# Altium project SEMA_V7 Motor Controller4.12.PrjPcb (part 1 of 2)
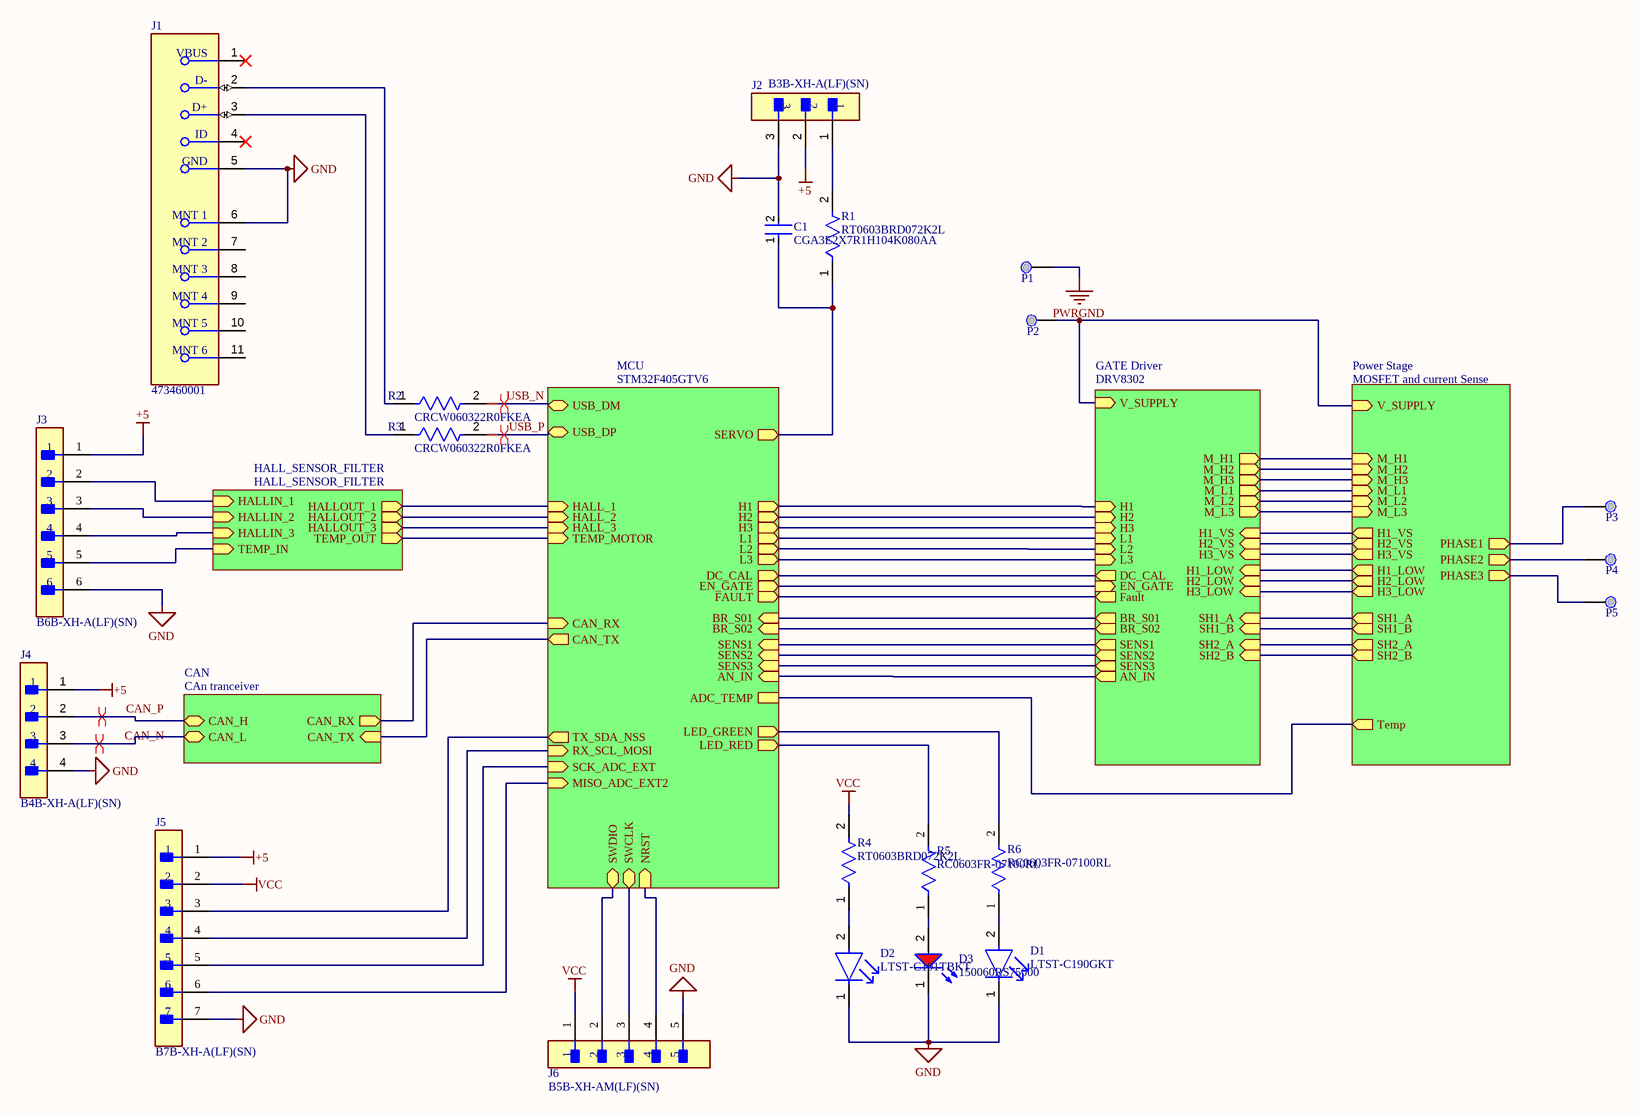
[diagram p0: General.SchDoc]
6 sheets, 124 parts. Net scope: hierarchical (ports join the sheet entries above them; power ports are global).
Board file: PCB.PcbDoc
Sheets:
  General.SchDoc
    MCU = STM32F405GTV6.SchDoc
    GATE Driver = DRV8302.SchDoc
    Power Stage = MOSFET and current Sense.SchDoc
    HALL_SENSOR_FILTER = HALL_SENSOR_FILTER.SchDoc
    CAN = CAn tranceiver.SchDoc

## Sheet General.SchDoc
size 431 x 279 mm; SheetNumber: 1; SheetTotal: 6

### Parts
C1  CGA3E2X7R1H104K080AA  [FP-CGA3E-0_3-0_1-IPC_A]
D1  LTST-C190GKT  [FP-LTST-C190GKT-MFG]
D2  LTST-C191TBKT  [FP-LTST-C191TBKT-MFG]
D3  150060RS75000  [WL-SMCW_0603_150060xx75000]
J1  473460001  [FP-473460001-MFG]
J2  B3B-XH-A(LF)(SN)  [FP-B3B-XH-A_LF_SN-MFG]
J3  B6B-XH-A(LF)(SN)  [FP-B6B-XH-A_LF_SN-MFG]
J4  B4B-XH-A(LF)(SN)  [FP-B4B-XH-A_LF_SN-MFG]
J5  B7B-XH-A(LF)(SN)  [FP-B7B-XH-A_LF_SN-MFG]
J6  B5B-XH-AM(LF)(SN)  [FP-B5B-XH-AM_LF_SN-MFG]
P1  Power_Pad  [PowerPad]  (value not drawn)
P2  Power_Pad  [PowerPad]  (value not drawn)
P3  Power_Pad  [PowerPad]  (value not drawn)
P4  Power_Pad  [PowerPad]  (value not drawn)
P5  Power_Pad  [PowerPad]  (value not drawn)
R1  RT0603BRD072K2L  [FP-RT0603-MFG]
R2  CRCW060322R0FKEA  [FP-CRCW0603-e3-IPC_B]
R3  CRCW060322R0FKEA  [FP-CRCW0603-e3-IPC_B]
R4  RT0603BRD072K2L  [FP-RT0603-MFG]
R5  RC0603FR-07100RL  [FP-RC0603-0_55-MFG]
R6  RC0603FR-07100RL  [FP-RC0603-0_55-MFG]

### Sub-sheets
CAN = CAn tranceiver: CAN_RX (out), CAN_TX (in), CAN_H (bidir), CAN_L (bidir)
GATE Driver = DRV8302: H1 (in), H2 (in), H3 (in), L1 (in), L2 (in), L3 (in), Fault (out), DC_CAL (out), EN_GATE (in), BR_S01 (out), BR_S02 (out), SENS1 (out), SENS2 (out), SENS3 (out), V_SUPPLY (in), AN_IN (out), SH1_A (in), SH1_B (in), SH2_A (in), SH2_B (in), M_H1 (out), M_H2 (out), M_H3 (out), M_L1 (out), M_L2 (out), M_L3 (out), H1_VS (in), H2_VS (in), H3_VS (in), H1_LOW (in), H2_LOW (in), H3_LOW (in)
HALL_SENSOR_FILTER = HALL_SENSOR_FILTER: HALLIN_1 (in), HALLIN_2 (in), HALLIN_3 (in), TEMP_IN (in), TEMP_OUT (out), HALLOUT_1 (out), HALLOUT_2 (out), HALLOUT_3 (out)
MCU = STM32F405GTV6: HALL_1 (in), HALL_2 (in), HALL_3 (in), TEMP_MOTOR (in), USB_DM (bidir), USB_DP (bidir), CAN_RX (in), CAN_TX (out), H1 (out), H2 (out), H3 (out), L1 (out), L2 (out), L3 (out), DC_CAL (out), EN_GATE (out), FAULT (out), BR_S01 (in), BR_S02 (in), SENS1 (in), SENS2 (in), SENS3 (in), ADC_TEMP, AN_IN (in), LED_GREEN (out), LED_RED (out), TX_SDA_NSS (out), SCK_ADC_EXT (in), MISO_ADC_EXT2 (in), RX_SCL_MOSI (in), SERVO (out), SWDIO (bidir), SWCLK (bidir), NRST (in)
Power Stage = MOSFET and current Sense: V_SUPPLY (in), M_H1 (in), M_H2 (in), M_H3 (in), M_L1 (in), M_L2 (in), M_L3 (in), H1_VS (out), H2_VS (out), H3_VS (out), H1_LOW (out), H2_LOW (out), H3_LOW (out), SH1_A (out), SH1_B (out), SH2_A (out), SH2_B (out), PHASE1 (out), PHASE2 (out), PHASE3 (out), Temp (out)

### Nets
+5: J2.2 J3.1 J4.1 J5.1
GND: C1.2 D1.1(C) D2.1(C) D3.1(K) J1.5(GND) J1.6(MNT_1) J2.3 J3.6 J4.4 J5.7 J6.5 P1.P?(Power) ; sheet GATE Driver/H2_LOW, sheet Power Stage/H2_LOW  [also labelled PWRGND]  [project net H2_LOW]
VCC: J5.2 J6.1 R4.2
CAN_N: J4.3 ; sheet CAN/CAN_L
CAN_P: J4.2 ; sheet CAN/CAN_H
CURR_1_N: sheet GATE Driver/SH2_B, sheet Power Stage/SH2_B
CURR_1_P: sheet GATE Driver/SH2_A, sheet Power Stage/SH2_A
CURR_2_N: sheet GATE Driver/SH1_B, sheet Power Stage/SH1_B
CURR_2_P: sheet GATE Driver/SH1_A, sheet Power Stage/SH1_A
H1_LOW: sheet GATE Driver/H1_LOW, sheet Power Stage/H1_LOW
H1_VS: P3.P?(Power) ; sheet GATE Driver/H1_VS, sheet Power Stage/H1_VS, sheet Power Stage/PHASE1
H2_VS: P4.P?(Power) ; sheet GATE Driver/H2_VS, sheet Power Stage/H2_VS, sheet Power Stage/PHASE2
H3_LOW: sheet GATE Driver/H3_LOW, sheet Power Stage/H3_LOW
H3_VS: P5.P?(Power) ; sheet GATE Driver/H3_VS, sheet Power Stage/H3_VS, sheet Power Stage/PHASE3
RX_SCL_MOSI: J5.4 ; sheet MCU/RX_SCL_MOSI
TX_SDA_NSS: J5.3 ; sheet MCU/TX_SDA_NSS
USB_N: R2.2 ; sheet MCU/USB_DM
USB_P: R3.2 ; sheet MCU/USB_DP
V_SUPPLY: P2.P?(Power) ; sheet GATE Driver/V_SUPPLY, sheet Power Stage/V_SUPPLY
NetC1_1: C1.1 R1.1 ; sheet MCU/SERVO
NetC2_1: J6.4 ; sheet MCU/NRST
NetC13_1: J3.5 ; sheet MCU/TEMP_MOTOR, sheet HALL_SENSOR_FILTER/TEMP_IN, sheet HALL_SENSOR_FILTER/TEMP_OUT
NetC14_1: sheet MCU/HALL_1, sheet HALL_SENSOR_FILTER/HALLOUT_1
NetC15_1: sheet MCU/HALL_2, sheet HALL_SENSOR_FILTER/HALLOUT_2
NetC16_1: sheet MCU/HALL_3, sheet HALL_SENSOR_FILTER/HALLOUT_3
NetC23_1: sheet MCU/AN_IN, sheet GATE Driver/AN_IN
NetC45_1: sheet MCU/ADC_TEMP, sheet Power Stage/Temp
NetD1_2: D1.2(A) R6.1
NetD2_2: D2.2(A) R4.1
NetD3_2: D3.2(A) R5.1
NetJ1_2: J1.2(D-) R2.1
NetJ1_3: J1.3(D+) R3.1
NetJ2_1: J2.1 R1.2
NetJ3_2: J3.2 ; sheet HALL_SENSOR_FILTER/HALLIN_1
NetJ3_3: J3.3 ; sheet HALL_SENSOR_FILTER/HALLIN_2
NetJ3_4: J3.4 ; sheet HALL_SENSOR_FILTER/HALLIN_3
NetJ5_5: J5.5 ; sheet MCU/SCK_ADC_EXT
NetJ5_6: J5.6 ; sheet MCU/MISO_ADC_EXT2
NetJ6_2: J6.2 ; sheet MCU/SWDIO
NetJ6_3: J6.3 ; sheet MCU/SWCLK
NetR5_2: R5.2 ; sheet MCU/LED_RED
NetR6_2: R6.2 ; sheet MCU/LED_GREEN
NetR26_1: sheet MCU/SENS1, sheet GATE Driver/SENS1
NetR27_1: sheet MCU/SENS2, sheet GATE Driver/SENS2
NetR28_1: sheet MCU/SENS3, sheet GATE Driver/SENS3
NetR32_1: sheet GATE Driver/M_H1, sheet Power Stage/M_H1
NetR33_1: sheet GATE Driver/M_H2, sheet Power Stage/M_H2
NetR34_1: sheet GATE Driver/M_H3, sheet Power Stage/M_H3
NetR36_1: sheet GATE Driver/M_L1, sheet Power Stage/M_L1
NetR37_1: sheet GATE Driver/M_L2, sheet Power Stage/M_L2
NetR38_1: sheet GATE Driver/M_L3, sheet Power Stage/M_L3
NetU1_26: sheet MCU/BR_S02, sheet GATE Driver/BR_S02
NetU1_27: sheet MCU/BR_S01, sheet GATE Driver/BR_S01
NetU1_33: sheet MCU/DC_CAL, sheet GATE Driver/DC_CAL
NetU1_34: sheet MCU/L3, sheet GATE Driver/L3
NetU1_35: sheet MCU/L2, sheet GATE Driver/L2
NetU1_36: sheet MCU/L1, sheet GATE Driver/L1
NetU1_41: sheet MCU/H3, sheet GATE Driver/H3
NetU1_42: sheet MCU/H2, sheet GATE Driver/H2
NetU1_43: sheet MCU/H1, sheet GATE Driver/H1
NetU1_51: sheet MCU/EN_GATE, sheet GATE Driver/EN_GATE
NetU1_53: sheet MCU/FAULT, sheet GATE Driver/Fault
NetU1_61: sheet MCU/CAN_RX, sheet CAN/CAN_RX
NetU1_62: sheet MCU/CAN_TX, sheet CAN/CAN_TX

Not connected (* = marked no-connect by the designer): J1 1(VBUS)* 4(ID)* 7(MNT_2) 8(MNT_3) 9(MNT_4) 10(MNT_5) 11(MNT_6)

### Layout directives
differential pair: CAN_N, CAN_P, USB_N, USB_P

### Notes on the sheet
- DWG. NO.
- REV.
- SHT.
- THIS DOCUMENT AND THE DATA DISCLOSED HEREIN OR HEREWITH IS THE PROPERTY OF ALTIUM LIMITED AND MAY BE FREELY DISTRIBUTED IN WHOLE. NO RIGHTS ARE RESERVED OR EXPRESS OR IMPLIED WARANTEE GIVEN.
- REVISION
- DESCRIPTION
- DATE
- APPROVED
- ENG:
- APPROVALS
- PROJECT
- DSN:
- CHK:
- REFERENCE DOCUMENTS
- PROJECT REVISION:
- TITLE
- DOCUMENT REVISION:
- DESIGN ITEM:
- BOM:
- FAB DWG:
- PCB DWG:
- ASSY DWG:
- SCALE:
- SIZE
- B
- CAGE CODE
- FILE NAME
- DWG NO.
- SHEET
- OF
- REV

### Library data of the parts
C1 = CMP-2000-07546-2: Cap Ceramic 100nF 50V X7R 10% Pad SMD 0603 +125°C Automotive T/R; Weight: 7.1E-05oz; Composition: Ceramic; Max Operating Temperature: 125°C; Termination: SMD/SMT; Dielectric: X7R; Length: 1.6mm; Package Quantity: 1; REACH SVHC: No SVHC; Lead Free: Lead Free; Case Code (Metric): 1608; Min Operating Temperature: -55°C; Packaging: Tape and Reel; Tolerance: 10%; Voltage Rating: 50V; Case Code (Imperial): 0603; Capacitance: 100nF; Case/Package: 0603; Voltage Rating (DC): 50V; Depth: 0.8mm; Radiation Hardening: No; Ratings: AEC-Q200; Mount: Surface Mount; Voltage: 50V; Thickness: 0.035inch; Width: 0.8mm; Height: 0.8mm
D1 = CMP-22017-000005-2: LED GREEN CLEAR CHIP SMD; Dominant Wavelength: 569nm; Reverse Voltage: 5V; Lens Color: Colorless; Viewing Angle: 130°; Voltage: 2V; Forward Current: 30mA; Power Dissipation: 100mW; Luminous Intensity: 6mcd; Number of LEDs: 1; Forward Voltage: 2.1V; Wavelength: 565nm; Test Current: 10mA; Min Operating Temperature: -55°C; Lens Style: Clear; Mount: Surface Mount; Width: 0.8mm; Packaging: Tape and Reel; Lens Transparency: Clear; Case Code (Metric): 1608; Depth: 0.8mm; Case Code (Imperial): 0603; Case/Package: 0603; Number of Pins: 2; Max Operating Temperature: 85°C; Lead Free: Lead Free; Number of Elements: 1; Length: 1.6mm; Height: 0.8mm; Package Quantity: 1; Power Rating: 100mW; Radiation Hardening: No; Illumination Color: Green; Color: Green
D2 = CMP-22017-000008-1: LED BLUE CLEAR CHIP SMD; Lens Color: Colorless; Dominant Wavelength: 475nm; Forward Current: 20mA; Wavelength: 468nm; Viewing Angle: 130°; Power Dissipation: 76mW; Luminous Intensity: 180mcd; Reverse Voltage: 5V; Number of Elements: 1; Lens Style: Diffused; Forward Voltage: 3.8V; Max Power Dissipation: 75mW; Case Code (Metric): 1608; Packaging: Tape and Reel; Case/Package: 0603; Depth: 1.6mm; Mount: Surface Mount; Lead Free: Lead Free; Min Operating Temperature: -20°C; Lens Transparency: Clear; Illumination Color: Blue; Height: 0.55mm; Test Current: 20mA; Case Code (Imperial): 0603; Max Operating Temperature: 80°C; Number of Pins: 2; Length: 0.8mm; Radiation Hardening: No; Package Quantity: 1; Number of LEDs: 1; Width: 0.8mm; Color: Blue
D3 = CMP-1426-00001-3: NexarPartId: 29717776; Color: Red; Power Dissipation: 72mW; Max Reverse Voltage (DC): 5V; Peak Wavelength: 630nm; Viewing Angle: 140°; Forward Voltage: 2V; Luminous Intensity: 250mcd; Forward Current: 100mA; Dominant Wavelength: 625nm; Lens Style: Clear, Rectangular; Max Junction Temperature (Tj): 95°C; Test Current: 20mA; Mount: Surface Mount; Packaging: Tape and Reel; Case Code (Metric): 1608; Max Operating Temperature: 85°C; Case Code (Imperial): 0603; REACH SVHC: Unknown; Width: 800µm; Length: 1.6mm; Reverse Voltage: 5V; Height: 700µm; Case/Package: 0603; RoHS: Compliant; Wavelength: 625nm; Min Operating Temperature: -40°C
J1 = CMP-2000-05246-2: CONN RCPT USB2.0 MICRO B SMD R/A; Manufacturer: Molex; Conn Orientation: Right Angle; Is Female: yes; Shielding: true; Pitch: 0.65mm; Number Of Contacts: 5; Voltage Rating: 30V; Current Rating: 1.8A; Device Class L2: USB Connectors; Digikey Description: CONN RCPT USB2.0 MICRO B SMD R/A; Height: 2.945mm; RoHS: TRUE; ComponentLink2Description: Datasheet; Octopart: https://octopart.com/47346-0001-molex-7164928; Automotive: No; Package: 0; Category: Conn; Device Class L1: Connectors; Usb Standard: USB 2.0; Temperature: -30°C to +85°C; Temperature Range Low: -30°C; Footprint Url: https://www.molex.com/pdm_docs/sd/473460001_sd.pdf; ComponentLink2URL: https://www.molex.com/webdocs/datasheets/pdf/en-us/0473460001_IO_CONNECTORS.pdf; Lead Free: Yes; Manufacturer Part Number: 473460001; Contact Material: Gold,Nickel; Temperature Range High: +85°C; Device Class L3: unset
J2 = CMP-17439-000014-3: CONN HEADER VERT 3POS 2.5MM; Max Voltage Rating (DC): 250V; Number of Positions: 3; Current Rating: 3A; Gender: Male; Wire/Cable Gauge: 22AWG; Contact Resistance: 20mR; Insulation Resistance: 1GR; Insulation Material: Nylon; Contact Plating: Tin; Depth: 5.75mm; Contact Type: Male Pin; Max Operating Temperature: 85°C; Insulation Color: Natural; Voltage Rating (AC): 250V; Color: Natural; Connector Type: Header; Orientation: Straight; Fastening Type: Detent; Housing Color: White; Min Operating Temperature: -25°C; Termination: Solder; Voltage Rating: 250V; Series: XH; Pitch: 2.5mm; Contact Shape: Square; Number of Rows: 1; Lead Free: Lead Free; Packaging: Bulk; Mount: Through Hole; Flammability Rating: UL94 V-0; Max Voltage Rating (AC): 250V; REACH SVHC: No SVHC; Housing Material: Polyamide; Contact Material: Brass; Lead Pitch: 2.5mm; Contact Finish - Mating: TIN; Length: 9.9mm; Max Current Rating: 3A; Number of Contacts: 3
J3 = CMP-17439-000076-1: CONN HEADER VERT 6POS 2.5MM
J4 = CMP-17439-000250-1: CONN HEADER VERT 4POS 2.5MM; Number of Contacts: 4; Contact Resistance: 20mR; Voltage Rating: 250V; Max Current Rating: 3A; Gender: Male; Wire/Cable Gauge: 22AWG; Mated Stacking Heights: 9.8mm; Insulation Resistance: 1GR; Orientation: Straight; Contact Type: Male Pin; Contact Finish - Mating: TIN; Series: XH; Max Voltage Rating (AC): 250V; Lead Pitch: 2.5mm; Contact Shape: Square; Insulation Color: Natural; Termination: Solder; Lead Free: Lead Free; Voltage Rating (AC): 250V; Number of Rows: 1; Flammability Rating: UL94 V-0; Number of Positions: 4; Max Operating Temperature: 85°C; Package Quantity: 500; Mount: Through Hole; REACH SVHC: No SVHC; Connector Type: Header; Insulation Material: Nylon; Fastening Type: Detent; Min Operating Temperature: -25°C; Housing Color: White; Packaging: Bulk; Contact Plating: Tin; Contact Material: Brass; Max Voltage Rating (DC): 250V; Housing Material: Polyamide; Color: Natural; Material: Polyamide; Pitch: 2.5mm; Depth: 5.75mm; Current Rating: 3A; Length: 12.4mm
J5 = CMP-17439-000323-2: CONN HEADER VERT 7POS 2.5MM; Current Rating: 3A; Voltage Rating: 250V; Number of Contacts: 7; Mated Stacking Heights: 9.8mm; Insulation Resistance: 1GR; Contact Resistance: 20mR; Wire/Cable Gauge: 22AWG; Contact Finish - Mating: TIN; Orientation: Straight; REACH SVHC: No SVHC; Max Operating Temperature: 85°C; Housing Color: White; Pitch: 2.5mm; Mount: Through Hole; Packaging: Bulk; Depth: 5.75mm; Series: XH; Min Operating Temperature: -25°C; Length: 19.9mm; Connector Type: Header; Number of Positions: 7; Color: Natural; Max Current Rating: 3A; Lead Pitch: 2.5mm; Termination: Solder; Fastening Type: Detent; Flammability Rating: UL94 V-0; Voltage Rating (AC): 250V; Lead Free: Lead Free; Contact Material: Brass; Max Voltage Rating (AC): 250V; Contact Type: Male Pin; Housing Material: Polyamide; Insulation Color: Natural; Contact Shape: Square; Number of Rows: 1; Contact Plating: Tin; Insulation Material: Nylon
J6 = CMP-17439-000304-1: CONN HEADER VERT 5POS 2.5MM; Mated Stacking Heights: 9.8mm; Voltage Rating: 250V; Max Current Rating: 3A; Number of Positions: 5; Contact Resistance: 20mR; Depth: 5.75mm; Connector Type: Header; Color: Green; Insulation Material: Nylon; Contact Plating: Copper; Length: 14.9mm; Fastening Type: Detent; Contact Material: Brass; Number of Rows: 1; Contact Type: Male Pin; Housing Material: Polyamide; Housing Color: White; Lead Free: Lead Free; Max Voltage Rating (AC): 250V; Mount: Through Hole; Contact Shape: Square; Min Operating Temperature: -25°C; Packaging: Bulk; Orientation: Straight; Insulation Color: Natural; Series: XH; Flammability Rating: UL94 V-0; Contact Finish - Mating: TIN; Max Operating Temperature: 85°C; Termination: Solder; Pitch: 2.5mm
R1 R4 = CMP-2000-04423-2: RES 2.20K OHM 1/10W .1% SMD 0603; Manufacturer: Yageo; Power Rating: 0.1W; Tolerance: 0.001; Value: 2.2KΩ; Voltage Rating: 75V; Temperature Coefficient: 25 ppm/°C; Series: RT; Manufacturer Part Number: RT0603BRD072K2L; ComponentLink2URL: http://www.yageo.com/documents/recent/PYu-RT_1-to-0.01_RoHS_L_9.pdf; Octopart: https://octopart.com/rt0603brd072k2l-yageo-1186019; Digikey Description: RES 2.20K OHM 1/10W .1% SMD 0603; Device Class L1: Passive Components; Temperature: -55°C to +155°C; ComponentLink2Description: Datasheet; Mouser Description: High Precision-High Stability Chip Resistor Thin Film 0603 2.2kOhm 0.1% Paper T/R; RoHS: TRUE; Footprint Url: http://www.yageo.com/exep/pages/download/literatures/PYu-R_Mount_10.pdf; Height: 0.55mm; Device Class L2: Resistors; Temperature Range Low: -55°C; Ipc Land Pattern Name: RESC16080X45; Composition: Thin Film; Lead Free: Yes; Temperature Range High: +155°C; Category: Res; Automotive: No; Resistance: 2.2KΩ; Package: RT0603; Device Class L3: Chip SMD Resistors
R2 R3 = CMP-2000-03097-2: RES Thick Film, 22Ω, 1%, 0.1W, 100ppm/°C, 0603; Voltage Rating: 75V; Power Rating: 100mW; Resistance: 22R; Lead Free: Lead Free; Height: 0.45mm; Package Quantity: 5000; Weight: 7.1E-05oz; Width: 0.85mm; Length: 1.55mm; Mount: Surface Mount; Packaging: Tape and Reel; Termination: SMD/SMT; Temperature Coefficient: 100ppm/°C; Case/Package: 0603; Case Code (Metric): 1608; Radiation Hardening: No; Max Operating Temperature: 155°C; Military Standard: Not; Min Operating Temperature: -55°C; Case Code (Imperial): 0603; Contact Plating: Tin; Voltage Rating (DC): 75V; Tolerance: 1%; Depth: 0.85mm; Composition: Thick Film
R5 R6 = CMP-2100-03663-2: NexarPartId: 55402879; Voltage Rating: 50V; Power Rating: 100mW; Tolerance: 1%; Temperature Coefficient: 100ppm/°C; Resistance: 100Ω; Case/Package: 0603; Military Standard: Not; REACH SVHC: Unknown; Case Code (Metric): 0603; Max Operating Temperature: 155°C; Schedule B: 8533210045, 8533210045; Height: 450µm; Length: 1.6mm; Lead Free: Lead Free; Packaging: Tape & Reel; Case Code (Imperial): 0603; Composition: Thick Film; Min Operating Temperature: -55°C; Voltage Rating (DC): 50V; RoHS: Compliant; Depth: 800µm; Number of Pins: 2; Termination: SMD/SMT; Width: 800µm

## Sheet STM32F405GTV6.SchDoc
size 431 x 279 mm; SheetNumber: 2; SheetTotal: 6
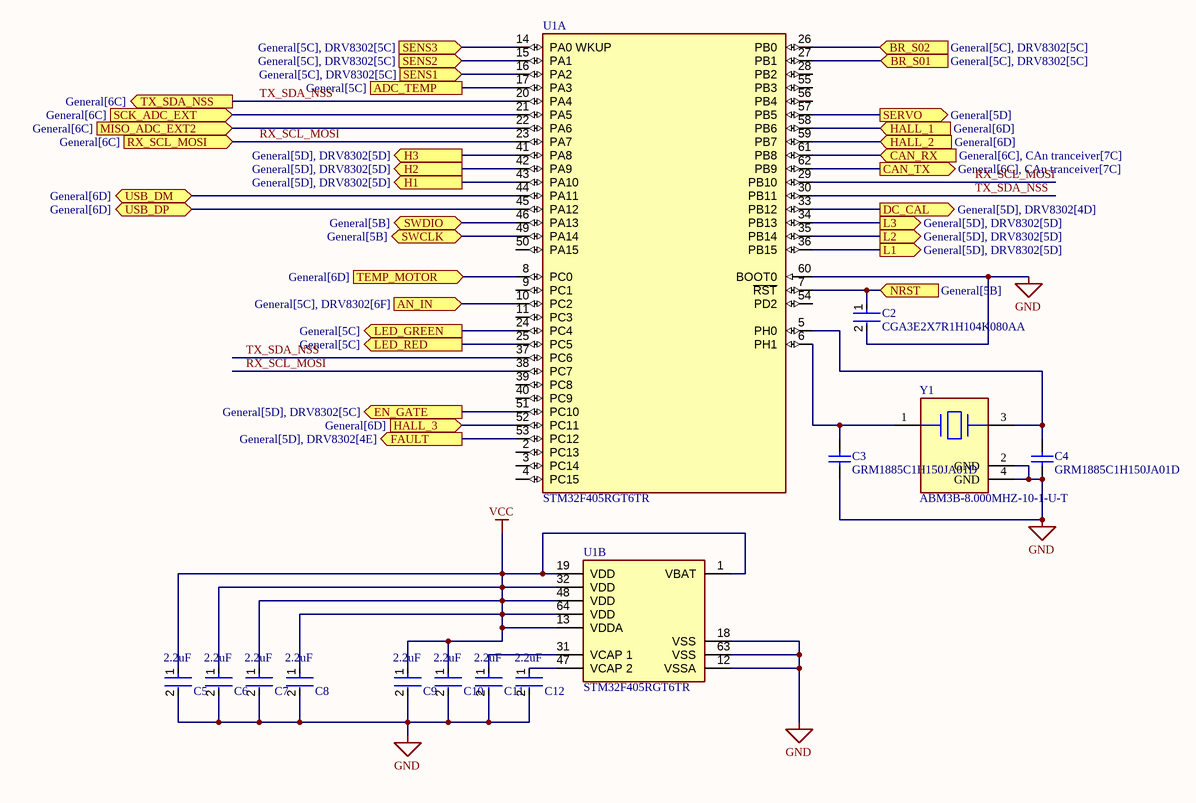
[diagram p1: STM32F405GTV6.SchDoc]

### Parts
C2  CGA3E2X7R1H104K080AA  [FP-CGA3E-0_3-0_1-IPC_A]
C3  GRM1885C1H150JA01D  [CAPC1608X90X35ML10T15]
C4  GRM1885C1H150JA01D  [CAPC1608X90X35ML10T15]
C5  Capacitance: 2.2uF  [FP-GRM188-0_1-e0_2_0_5-MFG]  (hidden comment: GRM188R71A225KE15D)
C6  Capacitance: 2.2uF  [FP-GRM188-0_1-e0_2_0_5-MFG]  (hidden comment: GRM188R71A225KE15D)
C7  Capacitance: 2.2uF  [FP-GRM188-0_1-e0_2_0_5-MFG]  (hidden comment: GRM188R71A225KE15D)
C8  Capacitance: 2.2uF  [FP-GRM188-0_1-e0_2_0_5-MFG]  (hidden comment: GRM188R71A225KE15D)
C9  Capacitance: 2.2uF  [FP-GRM188-0_1-e0_2_0_5-MFG]  (hidden comment: GRM188R71A225KE15D)
C10  Capacitance: 2.2uF  [FP-GRM188-0_1-e0_2_0_5-MFG]  (hidden comment: GRM188R71A225KE15D)
C11  Capacitance: 2.2uF  [FP-GRM188-0_1-e0_2_0_5-MFG]  (hidden comment: GRM188R71A225KE15D)
C12  Capacitance: 2.2uF  [FP-GRM188-0_1-e0_2_0_5-MFG]  (hidden comment: 2u2)
U1  STM32F405RGT6TR  [FP-LQFP64-5W-IPC_C]  (parts A,B of 2)
Y1  ABM3B-8.000MHZ-10-1-U-T  [FP-ABM3B-MFG]

### Ports
ADC_TEMP (see General[5C]), AN_IN (in, see General[5C], DRV8302[6F]), BR_S01 (in, see General[5C], DRV8302[5C]), BR_S02 (in, see General[5C], DRV8302[5C]), CAN_RX (in, see General[6C], CAn tranceiver[7C]), CAN_TX (out, see General[6C], CAn tranceiver[7C]), DC_CAL (out, see General[5D], DRV8302[4D]), EN_GATE (out, see General[5D], DRV8302[5C]), FAULT (out, see General[5D], DRV8302[4E]), H1 (out, see General[5D], DRV8302[5D]), H2 (out, see General[5D], DRV8302[5D]), H3 (out, see General[5D], DRV8302[5D]), HALL_1 (in, see General[6D]), HALL_2 (in, see General[6D]), HALL_3 (in, see General[6D]), L1 (out, see General[5D], DRV8302[5D]), L2 (out, see General[5D], DRV8302[5D]), L3 (out, see General[5D], DRV8302[5D]), LED_GREEN (out, see General[5C]), LED_RED (out, see General[5C]), MISO_ADC_EXT2 (in, see General[6C]), NRST (in, see General[5B]), RX_SCL_MOSI (in, see General[6C]), SCK_ADC_EXT (in, see General[6C]), SENS1 (in, see General[5C], DRV8302[5C]), SENS2 (in, see General[5C], DRV8302[5C]), SENS3 (in, see General[5C], DRV8302[5C]), SERVO (out, see General[5D]), SWCLK (bidir, see General[5B]), SWDIO (bidir, see General[5B]), TEMP_MOTOR (in, see General[6D]), TX_SDA_NSS (out, see General[6C]), USB_DM (bidir, see General[6D]), USB_DP (bidir, see General[6D])

### Nets
GND: C2.2 C3.1 C4.1 C5.2 C6.2 C7.2 C8.2 C9.2 C10.2 C11.2 C12.2 U1.12(VSSA) U1.18(VSS) U1.60(BOOT0) U1.63(VSS) Y1.2(GND) Y1.4(GND)  [project net H2_LOW]
VCC: C5.1 C6.1 C7.1 C8.1 C9.1 C10.1 U1.1(VBAT) U1.13(VDDA) U1.19(VDD) U1.32(VDD) U1.48(VDD) U1.64(VDD)
RX_SCL_MOSI: U1.23(PA7) U1.29(PB10) U1.38(PC7) ; port RX_SCL_MOSI
TX_SDA_NSS: U1.20(PA4) U1.30(PB11) U1.37(PC6) ; port TX_SDA_NSS
USB_N: U1.44(PA11) ; port USB_DM
USB_P: U1.45(PA12) ; port USB_DP
NetC1_1: U1.57(PB5) ; port SERVO
NetC2_1: C2.1 U1.7(~{RST}) ; port NRST
NetC3_2: C3.2 U1.6(PH1) Y1.1
NetC4_2: C4.2 U1.5(PH0) Y1.3
NetC11_1: C11.1 U1.31(VCAP_1)
NetC12_1: C12.1 U1.47(VCAP_2)
NetC13_1: U1.8(PC0) ; port TEMP_MOTOR
NetC14_1: U1.58(PB6) ; port HALL_1
NetC15_1: U1.59(PB7) ; port HALL_2
NetC16_1: U1.52(PC11) ; port HALL_3
NetC23_1: U1.10(PC2) ; port AN_IN
NetC45_1: U1.17(PA3) ; port ADC_TEMP
NetJ5_5: U1.21(PA5) ; port SCK_ADC_EXT
NetJ5_6: U1.22(PA6) ; port MISO_ADC_EXT2
NetJ6_2: U1.46(PA13) ; port SWDIO
NetJ6_3: U1.49(PA14) ; port SWCLK
NetR5_2: U1.25(PC5) ; port LED_RED
NetR6_2: U1.24(PC4) ; port LED_GREEN
NetR26_1: U1.16(PA2) ; port SENS1
NetR27_1: U1.15(PA1) ; port SENS2
NetR28_1: U1.14(PA0_WKUP) ; port SENS3
NetU1_26: U1.26(PB0) ; port BR_S02
NetU1_27: U1.27(PB1) ; port BR_S01
NetU1_33: U1.33(PB12) ; port DC_CAL
NetU1_34: U1.34(PB13) ; port L3
NetU1_35: U1.35(PB14) ; port L2
NetU1_36: U1.36(PB15) ; port L1
NetU1_41: U1.41(PA8) ; port H3
NetU1_42: U1.42(PA9) ; port H2
NetU1_43: U1.43(PA10) ; port H1
NetU1_51: U1.51(PC10) ; port EN_GATE
NetU1_53: U1.53(PC12) ; port FAULT
NetU1_61: U1.61(PB8) ; port CAN_RX
NetU1_62: U1.62(PB9) ; port CAN_TX

Not connected (* = marked no-connect by the designer): U1 2(PC13) 3(PC14) 4(PC15) 9(PC1) 11(PC3) 28(PB2) 39(PC8) 40(PC9) 50(PA15) 54(PD2) 55(PB3) 56(PB4)

### Notes on the sheet
- DWG. NO.
- REV.
- SHT.
- THIS DOCUMENT AND THE DATA DISCLOSED HEREIN OR HEREWITH IS THE PROPERTY OF ALTIUM LIMITED AND MAY BE FREELY DISTRIBUTED IN WHOLE. NO RIGHTS ARE RESERVED OR EXPRESS OR IMPLIED WARANTEE GIVEN.
- REVISION
- DESCRIPTION
- DATE
- APPROVED
- ENG:
- APPROVALS
- PROJECT
- DSN:
- CHK:
- REFERENCE DOCUMENTS
- PROJECT REVISION:
- TITLE
- DOCUMENT REVISION:
- DESIGN ITEM:
- BOM:
- FAB DWG:
- PCB DWG:
- ASSY DWG:
- SCALE:
- SIZE
- B
- CAGE CODE
- FILE NAME
- DWG NO.
- SHEET
- OF
- REV

### Library data of the parts
C2 = CMP-2000-07546-2: as C1 on sheet General; Weight: 7.1E-05oz; Composition: Ceramic; Max Operating Temperature: 125°C; Termination: SMD/SMT; Dielectric: X7R; Length: 1.6mm; Package Quantity: 1; REACH SVHC: No SVHC; Lead Free: Lead Free; Case Code (Metric): 1608; Min Operating Temperature: -55°C; Packaging: Tape and Reel; Tolerance: 10%; Voltage Rating: 50V; Case Code (Imperial): 0603; Capacitance: 100nF; Case/Package: 0603; Voltage Rating (DC): 50V; Depth: 0.8mm; Radiation Hardening: No; Ratings: AEC-Q200; Mount: Surface Mount; Voltage: 50V; Thickness: 0.035inch; Width: 0.8mm; Height: 0.8mm
C3 C4 = CMP-2006-02610-1: Manufacturer: Murata; Part Number: GRM1885C1H150JA01D
C5-C12 = CMP-2006-02836-2: Chip Multilayer Ceramic Capacitors for General Purpose, 0603, 2.2uF, X7R, 15%, 10%, 10V; Case Code (Metric): 1608; Height: 0.8mm; Packaging: Cut Tape; Voltage: 10V; Lead Free: Lead Free; Min Operating Temperature: -55°C; Voltage Rating (DC): 10V; Max Operating Temperature: 125°C; Voltage Rating: 10V; Dielectric: X7R; Depth: 0.8mm; Case Code (Imperial): 0603; Termination: SMD/SMT; Case/Package: 0603; Number of Pins: 2; REACH SVHC: No SVHC; Mount: Surface Mount; Width: 0.031inch; Material: Ceramic; Package Quantity: 1; Weight: 7.1E-05oz; Length: 1.6mm; Thickness: 0.035inch; Tolerance: 10%
U1 = CMP-0243-00156-2: IC MCU 32BIT 1MB FLASH 64LQFP; Frequency: 168MHz; Number of SPI Channels: 3; Oscillator Type: Internal; Core Architecture: ARM; Number of UART Channels: 2; Max Supply Voltage: 3.6V; Watchdog Timer: Yes; RAM Size: 196KB; Interface: I2C; Max Power Dissipation: 435mW; Number of Timers/Counters: 14; Data Bus Width: 32b; Peripherals: Brown-out Detect/Reset; Number of ADC Channels: 16; Min Supply Voltage: 1.8V; Number of Programmable I/O: 51; Memory Size: 1024KB; Max Operating Temperature: 85°C; Package Quantity: 1000; Lead Free: Lead Free; Memory Type: FLASH; Case/Package: LQFP; Number of I2C Channels: 3; Contact Plating: Tin; Mount: Surface Mount; Min Operating Temperature: -40°C; Radiation Hardening: No; Number of USB Channels: 2; Packaging: Tape and Reel; Height: 1.45mm; Number of Pins: 64; Number of I/Os: 51; Max Frequency: 168MHz; Width: 10mm; Length: 10mm
Y1 = CMP-2000-05730-2: Crystal 8MHz ±10ppm 10pF SMD-4 5mm x 3.2mm; Series Resistance: 200R; Load Capacitance: 10pF; Max Operating Temperature: 60°C; Frequency: 8MHz; Height - Seated (Max): 0.043inch; Frequency Tolerance: 10ppm; Packaging: Tape and Reel; Lead Free: Lead Free; Case/Package: SMD/SMT; Series: ABM3B; Min Operating Temperature: -10°C; REACH SVHC: No SVHC; Length: 0.197inch; RoHS Compliant: Yes; Depth: 3.2mm; Height: 0.043inch; Number of Pins: 4; Mount: Surface Mount; Frequency Stability: 10ppm; Width: 0.126inch; ESR (Equivalent Series Resistance): 200R

## Sheet DRV8302.SchDoc
size 431 x 279 mm; SheetNumber: 4; SheetTotal: 6
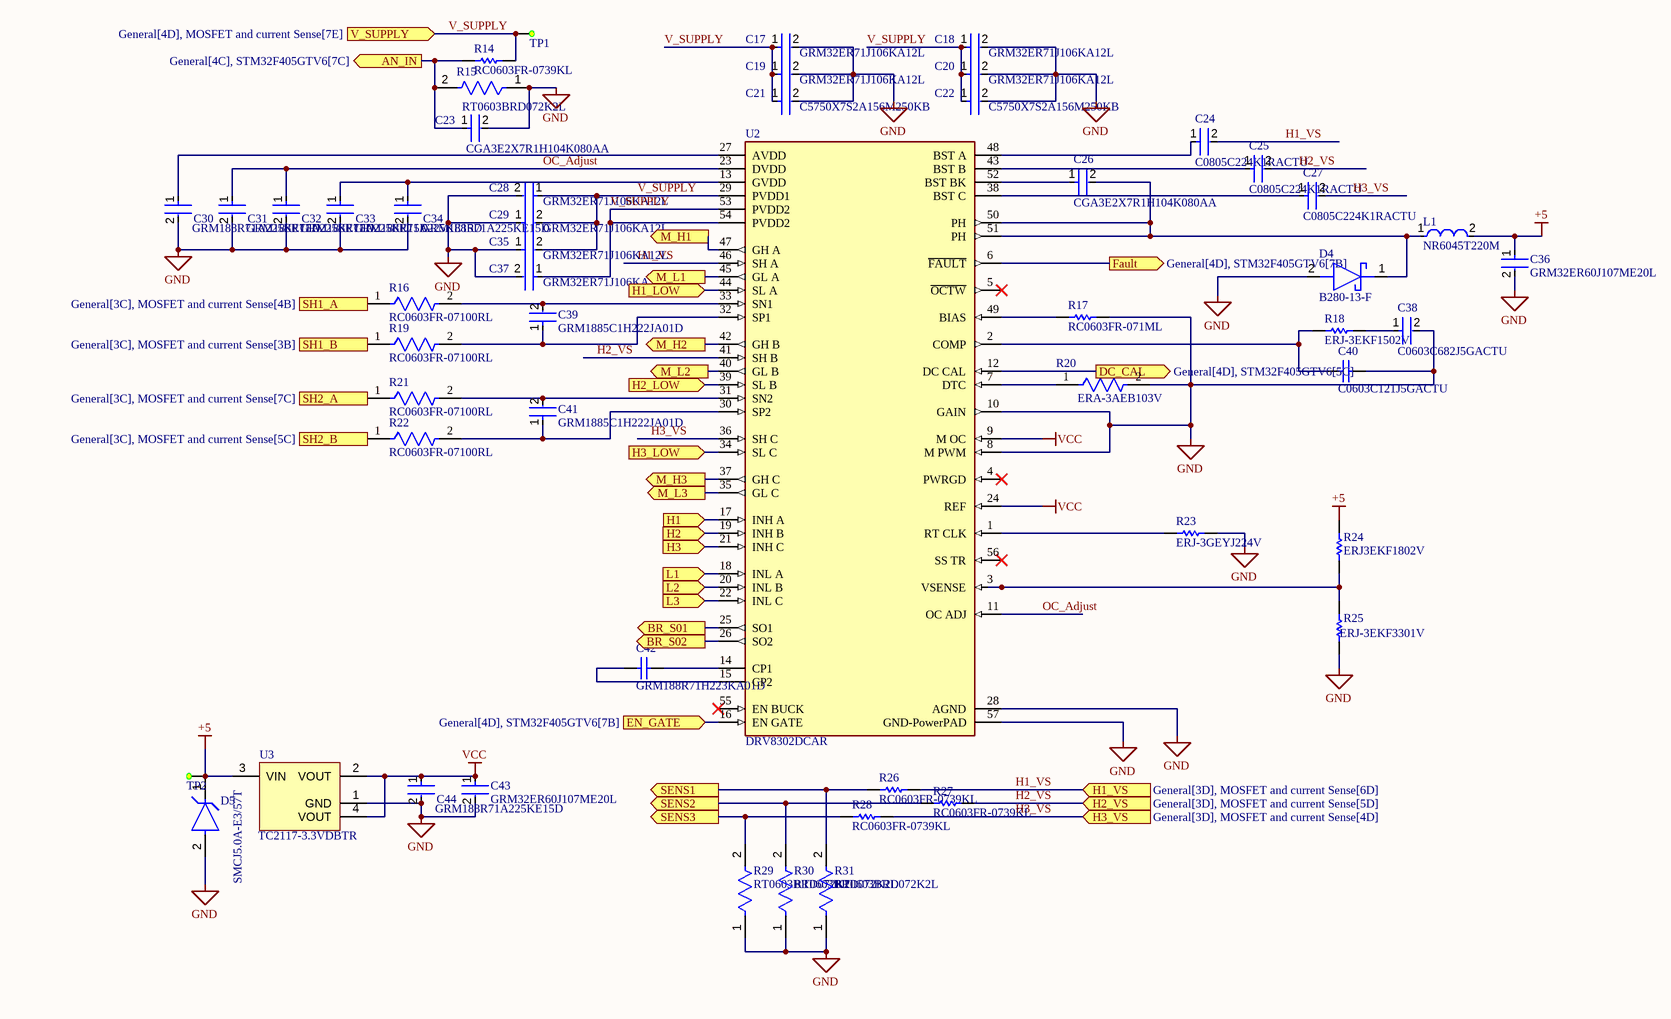
[diagram p2: DRV8302.SchDoc]

### Parts
C17  GRM32ER71J106KA12L  [FP-GRM32E-0_2-0_3-MFG]
C18  GRM32ER71J106KA12L  [FP-GRM32E-0_2-0_3-MFG]
C19  GRM32ER71J106KA12L  [FP-GRM32E-0_2-0_3-MFG]
C20  GRM32ER71J106KA12L  [FP-GRM32E-0_2-0_3-MFG]
C21  C5750X7S2A156M250KB  [FP-C5750-250-0_4-IPC_B]
C22  C5750X7S2A156M250KB  [FP-C5750-250-0_4-IPC_B]
C23  CGA3E2X7R1H104K080AA  [FP-CGA3E-0_3-0_1-IPC_A]
C24  C0805C224K1RACTU  [FP-C0805C-DN-MFG]
C25  C0805C224K1RACTU  [FP-C0805C-DN-MFG]
C26  CGA3E2X7R1H104K080AA  [FP-CGA3E-0_3-0_1-IPC_A]
C27  C0805C224K1RACTU  [FP-C0805C-DN-MFG]
C28  GRM32ER71J106KA12L  [FP-GRM32E-0_2-0_3-MFG]
C29  GRM32ER71J106KA12L  [FP-GRM32E-0_2-0_3-MFG]
C30  GRM188R71A225KE15D  [FP-GRM188-0_1-e0_2_0_5-MFG]
C31  GRM188R71A225KE15D  [FP-GRM188-0_1-e0_2_0_5-MFG]
C32  GRM188R71A225KE15D  [FP-GRM188-0_1-e0_2_0_5-MFG]
C33  GRM188R71A225KE15D  [FP-GRM188-0_1-e0_2_0_5-MFG]
C34  GRM188R71A225KE15D  [FP-GRM188-0_1-e0_2_0_5-MFG]
C35  GRM32ER71J106KA12L  [FP-GRM32E-0_2-0_3-MFG]
C36  GRM32ER60J107ME20L  [FP-GRM32-0_3-MFG]
C37  GRM32ER71J106KA12L  [FP-GRM32E-0_2-0_3-MFG]
C38  C0603C682J5GACTU  [FP-C0603C-CF-MFG]
C39  GRM1885C1H222JA01D  [FP-GRM188-0_1-e0_2_0_5-MFG]
C40  C0603C121J5GACTU  [CAPC1608X87X35LL15T15]
C41  GRM1885C1H222JA01D  [FP-GRM188-0_1-e0_2_0_5-MFG]
C42  GRM188R71H223KA01D  [CAPC1608X90X35ML10T15]
C43  GRM32ER60J107ME20L  [FP-GRM32-0_3-MFG]
C44  GRM188R71A225KE15D  [FP-GRM188-0_1-e0_2_0_5-MFG]
D4  B280-13-F  [DIOM5336X250N]
D5  SMCJ5.0A-E3/57T  [FP-95402-MFG]
L1  NR6045T220M  [FP-NR6045-MFG]
R14  RC0603FR-0739KL  [RESC1608X55X25LL10T15]
R15  RT0603BRD072K2L  [FP-RT0603-MFG]
R16  RC0603FR-07100RL  [FP-RC0603-0_55-MFG]
R17  RC0603FR-071ML  [RESC1608X55X25LL10T15]
R18  ERJ-3EKF1502V  [RESC1608X55X30NL15T15]
R19  RC0603FR-07100RL  [FP-RC0603-0_55-MFG]
R20  ERA-3AEB103V  [FP-ERA3A-IPC_C]
R21  RC0603FR-07100RL  [FP-RC0603-0_55-MFG]
R22  RC0603FR-07100RL  [FP-RC0603-0_55-MFG]
R23  ERJ-3GEYJ224V  [RESC1608X55X30LL15T15]
R24  ERJ3EKF1802V  [RESC1608X55X30LL15T15]
R25  ERJ-3EKF3301V  [RESC1609X55X30ML15T15]
R26  RC0603FR-0739KL  [RESC1608X55X25LL10T15]
R27  RC0603FR-0739KL  [RESC1608X55X25LL10T15]
R28  RC0603FR-0739KL  [RESC1608X55X25LL10T15]
R29  RT0603BRD072K2L  [FP-RT0603-MFG]
R30  RT0603BRD072K2L  [FP-RT0603-MFG]
R31  RT0603BRD072K2L  [FP-RT0603-MFG]
TP1  Test point  [Test point]  (value not drawn)
TP2  Test point  [Test point]  (value not drawn)
U2  DRV8302DCAR  [FP-DCA0056A-IPC_C]
U3  TC2117-3.3VDBTR  [SOT-223-DB3_N]

### Ports
AN_IN (out, see General[4C], STM32F405GTV6[7C]), BR_S01 (out, see General[4C], STM32F405GTV6[5D]), BR_S02 (out, see General[4C], STM32F405GTV6[5D]), DC_CAL (out, see General[4D], STM32F405GTV6[5C]), EN_GATE (in, see General[4D], STM32F405GTV6[7B]), Fault (out, see General[4D], STM32F405GTV6[7B]), H1 (in, see General[4D], STM32F405GTV6[7C]), H1_LOW (in, see General[3D], MOSFET and current Sense[6C]), H1_VS (in, see General[3D], MOSFET and current Sense[6D]), H2 (in, see General[4D], STM32F405GTV6[7C]), H2_LOW (in, see General[3D], MOSFET and current Sense[5C]), H2_VS (in, see General[3D], MOSFET and current Sense[5D]), H3 (in, see General[4D], STM32F405GTV6[7C]), H3_LOW (in, see General[3D], MOSFET and current Sense[3C]), H3_VS (in, see General[3D], MOSFET and current Sense[4D]), L1 (in, see General[4D], STM32F405GTV6[5C]), L2 (in, see General[4D], STM32F405GTV6[5C]), L3 (in, see General[4D], STM32F405GTV6[5C]), M_H1 (out, see General[3D], MOSFET and current Sense[7E]), M_H2 (out, see General[3D], MOSFET and current Sense[6E]), M_H3 (out, see General[3D], MOSFET and current Sense[4E]), M_L1 (out, see General[3D], MOSFET and current Sense[7D]), M_L2 (out, see General[3D], MOSFET and current Sense[5D]), M_L3 (out, see General[3D], MOSFET and current Sense[4D]), SENS1 (out, see General[4C], STM32F405GTV6[7D]), SENS2 (out, see General[4C], STM32F405GTV6[7D]), SENS3 (out, see General[4C], STM32F405GTV6[7D]), SH1_A (in, see General[3C], MOSFET and current Sense[4B]), SH1_B (in, see General[3C], MOSFET and current Sense[3B]), SH2_A (in, see General[3C], MOSFET and current Sense[7C]), SH2_B (in, see General[3C], MOSFET and current Sense[5C]), V_SUPPLY (in, see General[4D], MOSFET and current Sense[7E])

### Nets
+5: C36.1 D5.1(C) L1.2 R24.2 TP2.TP?(Test_point) U3.3(VIN)
GND: C17.2 C18.2 C19.2 C20.2 C21.2 C22.2 C23.2 C28.2 C29.1 C30.2 C31.2 C32.2 C33.2 C34.2 C35.1 C36.2 C37.2 C38.2 C40.2 C43.2 C44.2 D4.2(A) D5.2(A) R15.1 R17.2 R20.2 R23.2 R25.1 R29.1 R30.1 R31.1 U2.8(M_PWM) U2.10(GAIN) U2.28(AGND) U2.39(SL_B) U2.57(GND-PowerPAD) U3.1(GND) ; port H2_LOW  [project net H2_LOW]
VCC: C43.1 C44.1 U2.9(M_OC) U2.24(REF) U3.2(VOUT) U3.4(VOUT)
CURR_1_N: R22.1 ; port SH2_B
CURR_1_P: R21.1 ; port SH2_A
CURR_2_N: R19.1 ; port SH1_B
CURR_2_P: R16.1 ; port SH1_A
H1_LOW: U2.44(SL_A) ; port H1_LOW
H1_VS: C24.2 R26.2 U2.46(SH_A) ; port H1_VS
H2_VS: C25.2 R27.2 U2.41(SH_B) ; port H2_VS
H3_LOW: U2.34(SL_C) ; port H3_LOW
H3_VS: C27.2 R28.2 U2.36(SH_C) ; port H3_VS
OC_Adjust: C31.1 C32.1 U2.11(OC_ADJ) U2.23(DVDD)
V_SUPPLY: C17.1 C18.1 C19.1 C20.1 C21.1 C22.1 C28.1 C29.2 C35.2 C37.1 R14.2 TP1.TP?(Test_point) U2.29(PVDD1) U2.53(PVDD2) U2.54(PVDD2) ; port V_SUPPLY
NetC23_1: C23.1 R14.1 R15.2 ; port AN_IN
NetC24_1: C24.1 U2.48(BST_A)
NetC25_1: C25.1 U2.43(BST_B)
NetC26_1: C26.1 U2.52(BST_BK)
NetC26_2: C26.2 D4.1(K) L1.1 U2.50(PH) U2.51(PH)
NetC27_1: C27.1 U2.38(BST_C)
NetC30_1: C30.1 U2.27(AVDD)
NetC33_1: C33.1 C34.1 U2.13(GVDD)
NetC38_1: C38.1 R18.2
NetC39_1: C39.1 R19.2 U2.32(SP1)
NetC39_2: C39.2 R16.2 U2.33(SN1)
NetC40_1: C40.1 R18.1 U2.2(COMP)
NetC41_1: C41.1 R22.2 U2.30(SP2)
NetC41_2: C41.2 R21.2 U2.31(SN2)
NetC42_1: C42.1 U2.15(CP2)
NetC42_2: C42.2 U2.14(CP1)
NetR17_1: R17.1 U2.49(BIAS)
NetR20_1: R20.1 U2.7(DTC)
NetR23_1: R23.1 U2.1(RT_CLK)
NetR24_1: R24.1 R25.2 U2.3(VSENSE)
NetR26_1: R26.1 R31.2 ; port SENS1
NetR27_1: R27.1 R30.2 ; port SENS2
NetR28_1: R28.1 R29.2 ; port SENS3
NetR32_1: U2.47(GH_A) ; port M_H1
NetR33_1: U2.42(GH_B) ; port M_H2
NetR34_1: U2.37(GH_C) ; port M_H3
NetR36_1: U2.45(GL_A) ; port M_L1
NetR37_1: U2.40(GL_B) ; port M_L2
NetR38_1: U2.35(GL_C) ; port M_L3
NetU1_26: U2.26(SO2) ; port BR_S02
NetU1_27: U2.25(SO1) ; port BR_S01
NetU1_33: U2.12(DC_CAL) ; port DC_CAL
NetU1_34: U2.22(INL_C) ; port L3
NetU1_35: U2.20(INL_B) ; port L2
NetU1_36: U2.18(INL_A) ; port L1
NetU1_41: U2.21(INH_C) ; port H3
NetU1_42: U2.19(INH_B) ; port H2
NetU1_43: U2.17(INH_A) ; port H1
NetU1_51: U2.16(EN_GATE) ; port EN_GATE
NetU1_53: U2.6(~{FAULT}) ; port Fault

Not connected (* = marked no-connect by the designer): U2 4(PWRGD)* 5(~{OCTW})* 55(EN_BUCK)* 56(SS_TR)*

### Notes on the sheet
- DWG. NO.
- REV.
- SHT.
- THIS DOCUMENT AND THE DATA DISCLOSED HEREIN OR HEREWITH IS THE PROPERTY OF ALTIUM LIMITED AND MAY BE FREELY DISTRIBUTED IN WHOLE. NO RIGHTS ARE RESERVED OR EXPRESS OR IMPLIED WARANTEE GIVEN.
- REVISION
- DESCRIPTION
- DATE
- APPROVED
- ENG:
- APPROVALS
- PROJECT
- DSN:
- CHK:
- REFERENCE DOCUMENTS
- PROJECT REVISION:
- TITLE
- DOCUMENT REVISION:
- DESIGN ITEM:
- BOM:
- FAB DWG:
- PCB DWG:
- ASSY DWG:
- SCALE:
- SIZE
- B
- CAGE CODE
- FILE NAME
- DWG NO.
- SHEET
- OF
- REV

### Library data of the parts
C17-C20 C28 C29 C35 C37 = CMP-2000-07458-2: CAP CER 10UF 63V X7R 1210; Material: Ceramic; Tolerance: 10%; Package Quantity: 1000; Weight: 0.00388oz; Voltage Rating (DC): 63V; Packaging: Tape and Reel; Length: 3.2mm; Width: 2.5mm; REACH SVHC: No SVHC; Max Operating Temperature: 125°C; Dielectric Material: Ceramic; Thickness: 0.106inch; Mount: Surface Mount; Case Code (Metric): 3225; Depth: 2.5mm; Voltage Rating: 63V; RoHS Compliant: Yes; Capacitance: 10uF; Lead Free: Lead Free; Dielectric: X7R; Case Code (Imperial): 1210; Min Operating Temperature: -55°C; Height: 2.5mm; Case/Package: 1210; Voltage: 63V; Termination: SMD/SMT
C21 C22 = CMP-2000-05460-2: Multilayer Ceramic Capacitors 15uF ±20% 100V X7S SMD 2220; Min Operating Temperature: -55°C; Weight: 0.016932oz; Length: 0.224inch; Depth: 5mm; Series: C; Mount: Surface Mount; RoHS Compliant: Yes; REACH SVHC: No SVHC; Width: 0.197inch; Case Code (Imperial): 2220; Capacitance: 15uF; Termination: SMD/SMT; Dielectric: X7S; Case Code (Metric): 5750; Tolerance: 20%; Lead Free: Lead Free; Resistor Type: Ceramic; Case/Package: 2220; Voltage Rating (DC): 100V; Packaging: Tape and Reel; Thickness: 0.11inch; Height: 2.5mm; Voltage Rating: 100V; Max Operating Temperature: 125°C; Package Quantity: 1
C23 C26 = CMP-2000-07546-2: as C1 on sheet General; Weight: 7.1E-05oz; Composition: Ceramic; Max Operating Temperature: 125°C; Termination: SMD/SMT; Dielectric: X7R; Length: 1.6mm; Package Quantity: 1; REACH SVHC: No SVHC; Lead Free: Lead Free; Case Code (Metric): 1608; Min Operating Temperature: -55°C; Packaging: Tape and Reel; Tolerance: 10%; Voltage Rating: 50V; Case Code (Imperial): 0603; Capacitance: 100nF; Case/Package: 0603; Voltage Rating (DC): 50V; Depth: 0.8mm; Radiation Hardening: No; Ratings: AEC-Q200; Mount: Surface Mount; Voltage: 50V; Thickness: 0.035inch; Width: 0.8mm; Height: 0.8mm
C24 C25 C27 = CMP-2007-03262-2: CAP CER 0.22UF 100V 10% X7R 0805; Manufacturer: KEMET; Material: Ceramic; Tolerance: 0.1; Value: 0.22 μF; Temperature Coefficient: 30ppm/°C; Temperature Range High: +125°C; Temperature Range Low: -55°C; Voltage Rating: 100 V; Device Class L2: Capacitors; Manufacturer Part Number: C0805C224K1RACTU; Octopart: https://octopart.com/c0805c224k1ractu-kemet-12818106; ComponentLink2URL: https://content.kemet.com/datasheets/KEM_C1003_C0G_SMD.pdf; RoHS: TRUE; Temperature: -55°C to +125°C; Ipc Land Pattern Name: CAPC200125X78; Category: Cap; ComponentLink2Description: Datasheet; Height: 0.88mm; Device Class L1: Passive Components; Digikey Description: CAP CER 0.22UF 100V 10% X7R 0805; Mouser Description: 0805 C 220nF Ceramic Multilayer Capacitor, 100 V, +125degC, X7R Dielec, +/-10%; Capacitance: 0.22 μF; Package: C0805C-DN; Lead Free: Yes; Automotive: No; Temperature Characteristic: X7R; Device Class L3: Ceramic Capacitors
C30-C34 C44 = CMP-2006-02836-2: as C5 on sheet STM32F405GTV6; Case Code (Metric): 1608; Height: 0.8mm; Packaging: Cut Tape; Voltage: 10V; Lead Free: Lead Free; Min Operating Temperature: -55°C; Voltage Rating (DC): 10V; Max Operating Temperature: 125°C; Voltage Rating: 10V; Dielectric: X7R; Depth: 0.8mm; Case Code (Imperial): 0603; Termination: SMD/SMT; Case/Package: 0603; Number of Pins: 2; REACH SVHC: No SVHC; Mount: Surface Mount; Width: 0.031inch; Material: Ceramic; Capacitance: 2.2uF; Package Quantity: 1; Weight: 7.1E-05oz; Length: 1.6mm; Thickness: 0.035inch; Tolerance: 10%
C36 C43 = CMP-2000-05259-2: CAP CER 100UF 6.3V X5R 1210; 3DS Part Number: 220-00002; Manufacturer: Murata; Temperature Coefficient: 15%; Material: Ceramic; Tolerance: 20%; Octopart: https://octopart.com/grm32er60j107me20l-murata-197007; ComponentLink2URL: https://search.murata.co.jp/Ceramy/image/img/A01X/G101/ENG/GRM32ER60J107ME20-01.pdf; Temperature Range High: +85°C; RoHS: TRUE; Device Class L3: Ceramic Capacitors; Manufacturer Part Number: GRM32ER60J107ME20L; Device Class L2: Capacitors; Voltage: 6.3V; Package: GRM32-0.3; Voltage Rating: 6.3V; Category: Cap; Device Class L1: Passive Components; Temperature Characteristic: X5R; Automotive: No; Digikey Description: CAP CER 100UF 6.3V X5R 1210; Temperature: -55°C to +85°C; Height: 2.7mm; Ipc Land Pattern Name: CAPC320250X250; Capacitance: 100uF; Temperature Range Low: -55°C; Lead Free: Yes; Value: 100uF; ComponentLink2Description: Datasheet
C38 = CMP-2006-03259-2: CAP CER 6800PF 50V 5% NP0 0603; Manufacturer: KEMET; Temperature Characteristic: C0G; Automotive Grade: Grade 1; Material: Ceramic; Capacitance: 6,800 pF; Tolerance: 0.05; Temperature Coefficient: 30ppm/°C; Value: 6,800 pF; Temperature Range Low: -55°C; RoHS: TRUE; Lead Free: Yes; Device Class L1: Passive Components; Temperature: -55°C to +125°C; Device Class L2: Capacitors; Device Class L3: Ceramic Capacitors; Octopart: https://octopart.com/c0603c682j5gactu-kemet-12793182; Package: C0603C-CF; Voltage Rating: 50 V; ComponentLink2URL: https://api.kemet.com/component-edge/download/datasheet/C0603C100J5GACAUTO.pdf; ComponentLink2Description: Datasheet; Category: Cap; Automotive: Yes; Temperature Range High: +125°C; Mouser Description: Multilayer Ceramic Capacitors MLCC - SMD/SMT 50volts 6800pF 5% C0G; Height: 0.87mm; Digikey Description: CAP CER 6800PF 50V 5% NP0 0603; Manufacturer Part Number: C0603C682J5GACTU
C39 C41 = CMP-06035-056041-1: Chip Multilayer Ceramic Capacitors for General Purpose, 0603, 2200pF, C0G, 30ppm/°C, 5%, 50V; Insulation Resistance: 10GR; Capacitance: 2.2nF; Min Operating Temperature: -55°C; Voltage: 50V; Tolerance: 5%; Height: 0.8mm; Packaging: Tape and Reel; Length: 1.6mm; Mount: Surface Mount; Temperature Coefficient: 30ppm/°C; Case Code (Metric): 1608; Case/Package: 0603; Lead Free: Lead Free; Voltage Rating: 50V; Termination: SMD/SMT; Max Operating Temperature: 125°C; Voltage Rating (DC): 50V; Number of Pins: 2; Dielectric: C0G; Material: Ceramic; Thickness: 0.035inch; REACH SVHC: No SVHC; Dielectric Material: Ceramic; Case Code (Imperial): 0603; Radiation Hardening: No; Package Quantity: 1; Width: 0.8mm; Depth: 0.8mm
C40 = CMP-2006-03074-1: Manufacturer: Kemet; Part Number: C0603C121J5GACTU
C42 = CMP-2006-02910-1: Manufacturer: Murata; Part Number: GRM188R71H223KA01D
D4 = B280-13-F: Schottky Diode; Manufacturer_Name: Diodes Incorporated; Datasheet Link: https://www.diodes.com/assets/Datasheets/ds30021.pdf; Height: 2.5mm; Manufacturer_Part_Number: B280-13-F; Mouser Part Number: 621-B280-13-F; Mouser Price/Stock: https://www.mouser.com/Search/Refine.aspx?Keyword=621-B280-13-F; Arrow Part Number: B280-13-F; Arrow Price/Stock: https://www.arrow.com/en/products/b280-13-f/diodes-incorporated
D5 = CMP-02577-000008-1: TVS DIODE 5V 9.2V DO214AB; Manufacturer: Vishay Semiconductor Diodes Division; Number Of Channels: 1; Breakdown Voltage: 6.4V; Standoff Height: 0mm; Peak Pulse Current: 163A; Peak Pulse Power: 1500W; Max Junction Temp: +150°C; Direction: Unidirectional; Digikey Description: TVS DIODE 5V 9.2V DO214AB; Mouser Description: TVS Diodes - Transient Voltage Suppressors 1500W 5.0V Unidirect; Manufacturer Part Number: SMCJ5.0A-E3/57T; Device Class L2: TVS Diodes; Height: 2.62mm; Temperature Range High: +150°C; Reverse Standoff Voltage: 5V; Package: 95402; Category: Diode; Temperature: -55°C to +150°C; Lead Free: Yes; ComponentLink2Description: Datasheet; Device Class L3: unset; Device Class L1: Circuit Protection; Automotive: No; Clamping Voltage: 9.2V; Octopart: https://octopart.com/smcj5.0a-e3%2F57t-vishay-39559239; ComponentLink2URL: https://www.vishay.com/docs/88394/smcj.pdf; Footprint Url: https://www.vishay.com/docs/95402/smc.pdf; Temperature Range Low: -55°C; RoHS: TRUE
L1 = CMP-14484-000872-1: Shielded Wirewound Inductor 22uH 20% 1.5A 0.1495Ω SMD; DC Resistance (DCR): 149.5mR; Self Resonant Frequency: 7MHz; Core Material: Ferrite; Saturation Current: 1.9A; Test Frequency: 100kHz; Mount: Surface Mount; RMS Current (Irms): 1.5A; Packaging: Tape and Reel; RoHS Compliant: Yes; Termination: SMD/SMT; Resistor Type: Wirewound; Inductance: 22uH; Inductance Tolerance: 20%; Number of Pins: 2; Series: NR; Height: 4.5mm; Package Quantity: 1500; Shielding: Shielded; Max Operating Temperature: 120°C; Length: 0.236inch; Halogen Free: Halogen Free; Width: 0.236inch; Min Operating Temperature: -25°C; Current Rating: 1.5A; Height - Seated (Max): 0.177inch; Case/Package: Nonstandard; Max DC Current: 1.5A; Tolerance: 20%
R14 R26-R28 = CMP-2000-06940-1: Chip Resistor, 39 KOhm, +/- 1%, 0.1 W, -55 to 155 degC, 0603 (1608 Metric), RoHS, Tape and Reel; Manufacturer: Yageo; Resistance: 39kOhms; Voltage Rating: 50V; Power Rating: 100mW; Temperature Coefficient: 100PPM/C; Product: ThickFilmResistorsGeneralPurpose; Case Code - in: 0603; Tolerance: 1%; Operating Temperature Range: -55Cto+155C; Series: RC; Package Description: 2-Pin Surface Mount Device, Body 1.6 x 0.8 mm; Datasheet URL: http://www.yageo.com/documents/recent/PYu-RC_Group_51_RoHS_L_7.pdf; Package Reference: 0603; Case Code - mm: 1608; Datasheet Version: Rev. 7, 05/2017; Mounting Technology: SurfaceMount; Packaging: Reel; Manufacturer URL: http://www.yageo.com/; Termination Style: SMD/SMT
R15 R29-R31 = CMP-2000-04423-2: as R1 on sheet General; Series: RT; Manufacturer Part Number: RT0603BRD072K2L; ComponentLink2URL: http://www.yageo.com/documents/recent/PYu-RT_1-to-0.01_RoHS_L_9.pdf; Octopart: https://octopart.com/rt0603brd072k2l-yageo-1186019; Digikey Description: RES 2.20K OHM 1/10W .1% SMD 0603; Device Class L1: Passive Components; Temperature: -55°C to +155°C; ComponentLink2Description: Datasheet; Mouser Description: High Precision-High Stability Chip Resistor Thin Film 0603 2.2kOhm 0.1% Paper T/R; RoHS: TRUE; Footprint Url: http://www.yageo.com/exep/pages/download/literatures/PYu-R_Mount_10.pdf; Height: 0.55mm; Device Class L2: Resistors; Temperature Range Low: -55°C; Ipc Land Pattern Name: RESC16080X45; Composition: Thin Film; Lead Free: Yes; Temperature Range High: +155°C; Category: Res; Automotive: No; Resistance: 2.2KΩ; Package: RT0603; Device Class L3: Chip SMD Resistors
R16 R19 R21 R22 = CMP-2100-03663-2: as R5 on sheet General; Case/Package: 0603; Military Standard: Not; REACH SVHC: Unknown; Case Code (Metric): 0603; Max Operating Temperature: 155°C; Schedule B: 8533210045, 8533210045; Height: 450µm; Length: 1.6mm; Lead Free: Lead Free; Packaging: Tape & Reel; Case Code (Imperial): 0603; Composition: Thick Film; Min Operating Temperature: -55°C; Voltage Rating (DC): 50V; RoHS: Compliant; Depth: 800µm; Number of Pins: 2; Termination: SMD/SMT; Width: 800µm
R17 = CMP-1659-00056-1: Chip Resistor, 1 MOhm, +/- 1%, 100 mW, -55 to 155 degC, 0603 (1608 Metric), RoHS, Tape and Reel; Voltage Rating (DC): 25 V; Tolerance: 20%; Case\Package: Radial; Capacitance: 1 mF; Min Operating Temperature: -40 degC; PackageDescription: 2-Pin Surface Mount Device, Body 1.6 x 0.8 mm; ComponentLink1Description: Manufacturer URL; Radiation Hardening: No; DatasheetVersion: Rev. 4, 02/2016; REACH SVHC: No SVHC; Length: 20 mm; Max Operating Temperature: 85 degC; Diameter: 10 mm; Packaging: Bulk; Package Quantity: 200; PackageReference: 0603; Mount: Through Hole; ComponentLink1URL: http://www.yageo.com/; ComponentLink2URL: http://www.yageo.com/documents/recent/PYu-RC_Group_51_RoHS_L_04.pdf; ComponentLink2Description: Datasheet; Width: 0 inch; Lead Pitch: 5 mm; RoHSCompliant: true; Voltage Rating: 25 V; Height: 20 mm
R18 = CMP-2000-00258-1: Manufacturer: Panasonic; Part Number: ERJ-3EKF1502V
R20 = CMP-2000-00874-2: RES SMD 10K OHM 0.1% 1/10W 0603; Voltage Rating (DC): 75V; Power Rating: 100mW; Resistance: 10kR; Temperature Coefficient: 25ppm/°C; Radiation Hardening: No; Width: 0.8mm; Depth: 0.8mm; Construction: Rectangular; Case Code (Metric): 1608; Package Quantity: 5000; Length: 1.6mm; Size Code: 0603; Case Code (Imperial): 0603; Termination: SMD/SMT; Contact Plating: Tin; Resistance Tolerance: 0.1%; Military Standard: Not; Packaging: Tape and Reel; Max Power Dissipation: 100mW; REACH SVHC: No SVHC; Series: ERA-3A; Voltage Rating: 75V; Lead Free: Lead Free; Technology: METAL FILM; RoHS Compliant: Yes; Max Operating Temperature: 155°C; Resistor Type: Thin Film; Min Operating Temperature: -55°C; Number of Pins: 2; Case/Package: 0603; Tolerance: 0.1%; Height: 0.45mm; Mount: Surface Mount; Number of Terminations: 2
R23 = CMP-2000-00749-1: Manufacturer: Panasonic; Part Number: ERJ-3GEYJ224V
R24 = CMP-1012-00650-3: Fixed Resistor, Metal Glaze/thick Film, 0.1W, 18000ohm, 75V, 1% +/-Tol, 100ppm/Cel, Surface Mount, 0603; Manufacturer: Panasonic; Part Number: ERJ3EKF1802V
R25 = CMP-2000-00436-2: Chip Resistors, 3.3 KOhm, +/- 1%, 0.1 W, 0603 (1608 Metric), -55 to 155 degC, RoHS, Tape and Reel; Manufacturer: Panasonic; Max Power Dissipation: 100mW; Voltage Rating: 75V; Temperature Coefficient: 100ppm/degreesC; Datasheet Version: 42095.0; Width: 0.8mm; Mount: SurfaceMount; Radiation Hardening: No; Package URL: http://www.st.com/st-web-ui/static/active/en/resource/technical/document/datasheet/CD00001320.pdf; Depth: 0.8mm; Package Description: 2-Pin Surface Mount Device, Body 1.6 x 0.85 mm; Package Quantity: 1; Contact Plating: Tin; Length: 1.6mm; Max Operating Temperature: 155degC; RoHSCompliant: true; Datasheet URL: https://industrial.panasonic.com/cdbs/www-data/pdf/RDA0000/AOA0000C283.pdf; Height: 0.022inch; Military Standard: Not; Termination: SMD/SMT; Case Code (Metric): 1608; Composition: ThickFilm; Resistance: 3.3KOhm; Packaging: TapeandReel; Min Operating Temperature: -55degC; Case/Package: 0603; Voltage Rating (DC): 75V; Lead Free: LeadFree; Package Reference: 0603; Power Rating: 100mW; Manufacturer URL: http://www.panasonic.com/; Case Code (Imperial): 0603; REACH SVHC: NoSVHC; Number of Terminations: 2; Number of Pins: 2; Tolerance: 1%
U2 = CMP-04915-000065-1: IC MOTOR DRIVER 8V-60V 56HTSSOP; Number of Outputs: 2; Min Supply Voltage: 8V; Nominal Supply Current: 15mA; Max Supply Voltage: 60V; Interface: Parallel; Output Current: 1.7A; Max Operating Temperature: 125°C; Min Operating Temperature: -40°C; Packaging: Tape and Reel; Number of Pins: 56; Radiation Hardening: No; Supply Current: 15mA; REACH SVHC: No SVHC; Case/Package: HTSSOP; Series: DRV8302; RoHS Compliant: Yes; Lead Free: Lead Free; Mount: Surface Mount; Package Quantity: 2000
U3 = CMP-0136-00509-1: 800 mA Fixed Low Dropout Positive Regulator, 3-Pin SOT-223, Extended Temperature, Tape and Reel; PackageVersion: revBB, Aug-2009; DatasheetVersion: revC, Oct-2006; PackageReference: SOT-223-DB3; PackageDescription: 3-Lead Plastic Small Outline Transistor (DB) [SOT-223]
TP1 TP2 = Test point: value: Test point